# EAGLE schematic can-udp-bridge_0_1 (EAGLE 7.2.0)
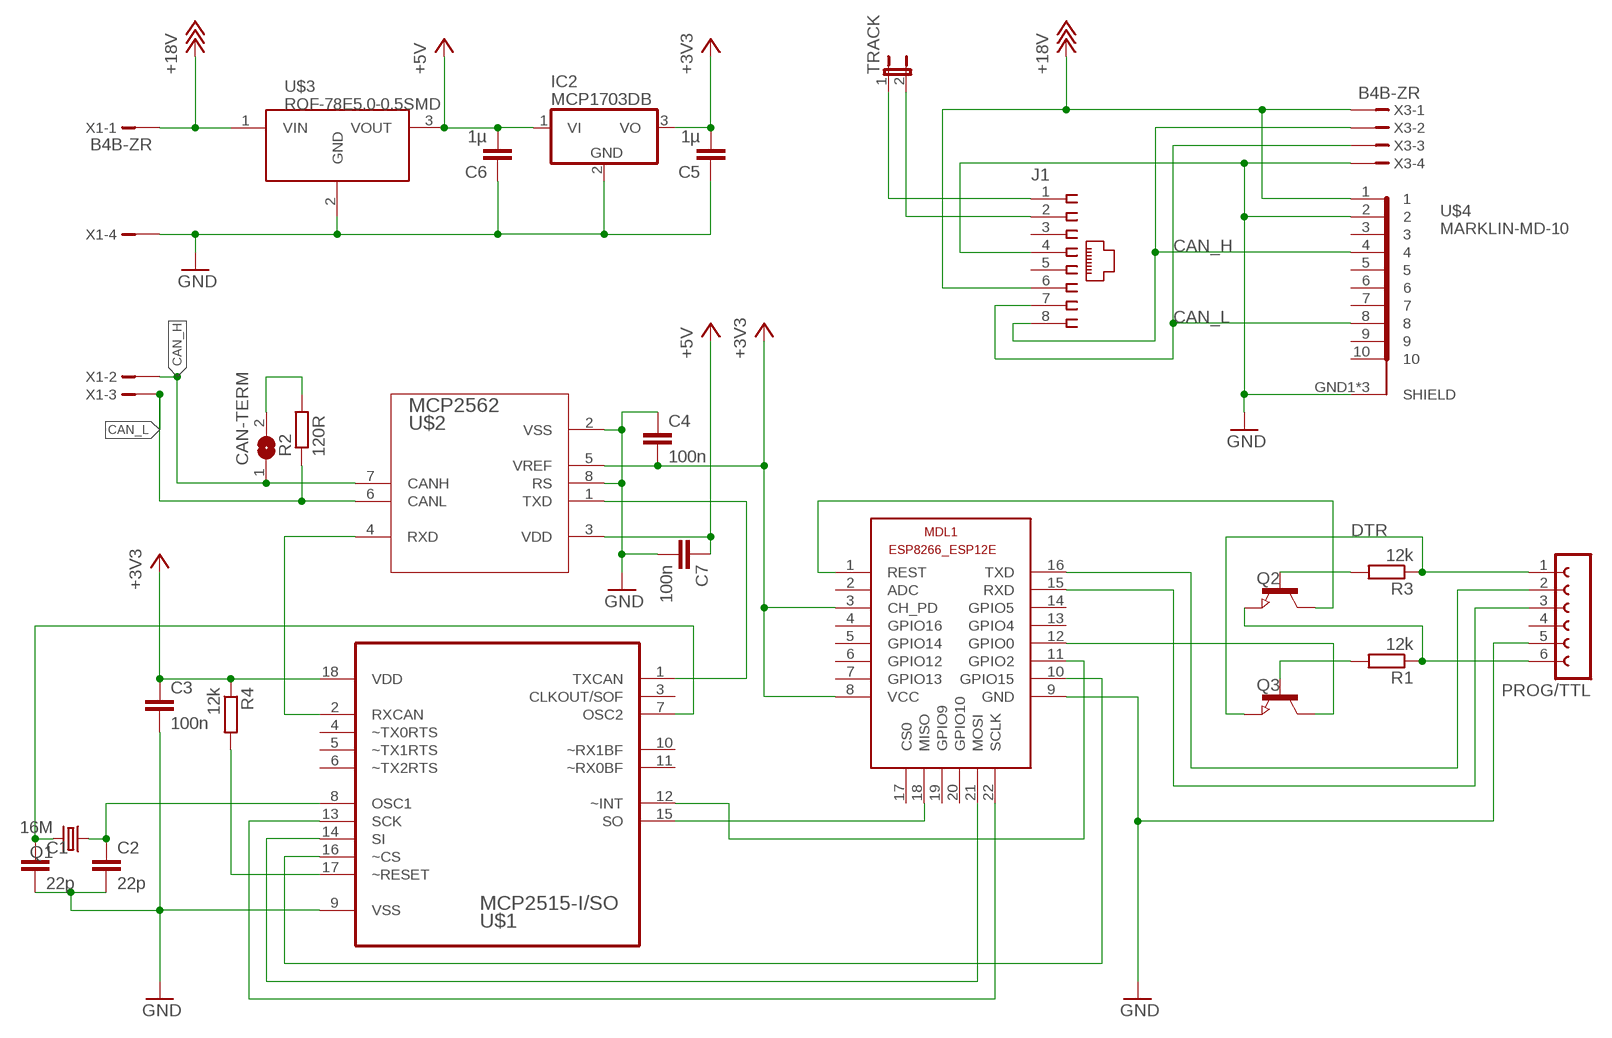
[diagram p0: schematic, sheet 1]

## Parts
C1  22p  C-EUC0805  [C0805]
C2  22p  C-EUC0805  [C0805]
C3  100n  C-EUC0805  [C0805]
C4  100n  C-EUC0805  [C0805]
C5  1µ  C-EUC0805  [C0805]
C6  1µ  C-EUC0805  [C0805]
C7  100n  C-EUC0805  [C0805]
CAN-TERM  SJ  [SJ]
IC2  MCP1703DB  [SOT223]
J1  215877-7  [215877-7]
MDL1  ESP8266-12EESP8266-ESP12E  [ESP8266-ESP12E]
PROG/TTL  FE06W  [FE06W]
Q1  16M  CRYSTALCTS406  [CTS406]
Q2  NPN-TRANSISTOR_SOT23  [SOT23]
Q3  NPN-TRANSISTOR_SOT23  [SOT23]
R1  12k  R-EU_R0805  [R0805]
R2  120R  R-EU_R0805  [R0805]
R3  12k  R-EU_R0805  [R0805]
R4  12k  R-EU_R0805  [R0805]
TRACK  JP1E  [JP1]
U$1  MCP2515-I/SO  [SOIC127P1034X264-18N]
U$2  MCP2562  MCP2551-E/SN  [SOIC127P600X175-8N]
U$3  ROF-78E5.0-0.5SMD  [ROF-78EXX-0.5SMD]
U$4  MARKLIN-MD-10  [MARKLIN-MD-10-PRINT]
X1  B4B-ZR  [B4B-ZR]
X3  B4B-ZR  [B4B-ZR]

## Nets
+3V3: C3.1 C4.2 C5.2 IC2.3(VO) MDL1.3(CH_PD) MDL1.8(VCC) R4.1 U$1.18(VDD) U$2.5(VREF)
+5V: C6.2 C7.1 IC2.1(VI) U$2.3(VDD) U$3.3(VOUT)
+18V: J1.6 U$3.1(VIN) U$4.1 X1.1 X3.1
CAN_H: CAN-TERM.1 J1.8 U$2.7(CANH) U$4.4 X1.2 X3.2
CAN_L: J1.7 R2.1 U$2.6(CANL) U$4.8 X1.3 X3.3
DTR: PROG/TTL.1 Q3.2(E) R3.1
GND: C1.2 C2.2 C3.2 C4.1 C5.1 C6.1 C7.2 IC2.2(GND) J1.4 MDL1.9(GND) PROG/TTL.5 U$1.9(VSS) U$2.2(VSS) U$2.8(RS) U$3.2(GND) U$4.2 U$4.GND1(SHIELD) U$4.GND2(SHIELD) U$4.GND3(SHIELD) X1.4 X3.4
N$1: U$1.1(TXCAN) U$2.1(TXD)
N$2: U$1.2(RXCAN) U$2.4(RXD)
N$3: PROG/TTL.6 Q2.2(E) R1.1
N$4: MDL1.1(REST) Q2.3(C)
N$5: MDL1.18(MISO) U$1.15(SO)
N$6: MDL1.10(GPIO15) U$1.16(~CS)
N$7: MDL1.21(MOSI) U$1.14(SI)
N$8: MDL1.11(GPIO2) U$1.12(~INT)
N$9: MDL1.22(SCLK) U$1.13(SCK)
N$10: MDL1.12(GPIO0) Q3.3(C)
N$11: Q3.1(B) R1.2
N$12: Q2.1(B) R3.2
N$13: C1.1 Q1.3 U$1.7(OSC2)
N$14: C2.1 Q1.1 U$1.8(OSC1)
N$15: CAN-TERM.2 R2.2
N$16: MDL1.16(TXD) PROG/TTL.2
N$17: MDL1.15(RXD) PROG/TTL.3
N$18: J1.2 TRACK.2
N$19: J1.1 TRACK.1
N$20: R4.2 U$1.17(~RESET)
Unconnected: J1.3 J1.5 MDL1.2(ADC) MDL1.4(GPIO16) MDL1.5(GPIO14) MDL1.6(GPIO12) MDL1.7(GPIO13) MDL1.13(GPIO4) MDL1.14(GPIO5) MDL1.17(CS0) MDL1.19(GPIO9) MDL1.20(GPIO10) PROG/TTL.4 U$1.3(CLKOUT/SOF) U$1.4(~TX0RTS) U$1.5(~TX1RTS) U$1.6(~TX2RTS) U$1.10(~RX1BF) U$1.11(~RX0BF) U$4.3 U$4.5 U$4.6 U$4.7 U$4.9 U$4.10

## Library data of the parts
C1-C7 = rcl:C-EU: CAPACITOR, European symbol
CAN-TERM = jumper:SJ: SMD solder JUMPER
IC2 = linear:MCP1703: 250 mA, 16V, Low Quiescent Current LDO Regulator Source: http://ww1.microchip.com/downloads/en/DeviceDoc/22049b.pdf
J1 = con-amp:215877-7: AMP connector
MDL1 = ESP8266-ESP12E:ESP8266-12E: ESP8266-12E with additional I/O and GPIO04/05 corrected The author cannot warrant that this library is free from error or will meet your specific requirements. Created by PuceBaboon.com. Komagane, Nagano, JAPAN
PROG/TTL = con-lsta:FE06W: FEMALE HEADER; OC_FARNELL: unknown; OC_NEWARK: unknown
Q1 = crystal:CRYSTAL: CRYSTAL; OC_FARNELL: unknown; OC_NEWARK: unknown
Q2 Q3 = semicon-smd-ipc:NPN-TRANSISTOR_: NPN TRANSISTOR
R1-R4 = rcl:R-EU_: RESISTOR, European symbol
TRACK = jumper:JP1E: JUMPER
U$1 = Microchip_By_element14_Batch_1:MCP2515-I/SO: CAN Controller; MPN: MCP2515-I/SO; OC_FARNELL: 1292239; OC_NEWARK: 29H7136; PACKAGE: SOIC-18; SUPPLIER: Microchip
U$2 = Microchip_By_element14_Batch_1:MCP2551-E/SN: High-Speed CAN Transceiver; DESCRIPTION: High-Speed CAN Transceiver; MPN: MCP2551-E/SN; OC_FARNELL: 1467746; OC_NEWARK: 92C4186; PACKAGE: SOIC-8; SUPPLIER: Microchip
U$3 = ROF-78XX:ROF-78E5.0-0.5SMD
U$4 = Marklin-Mini-DIN:MARKLIN-MD-10
X1 X3 = con-jst:?4B-ZR: ZH CONNECTOR 1.5 mm, 4 pin 1 row Source: http://www.jst.com .. eZH.pdf; MF: FARNELL; MPN: B4B-ZR(LF)(SN); OC_FARNELL: 1830916; OC_NEWARK: 37K9960